# Altium schematic sheet [01] CPU.SchDoc
size A4
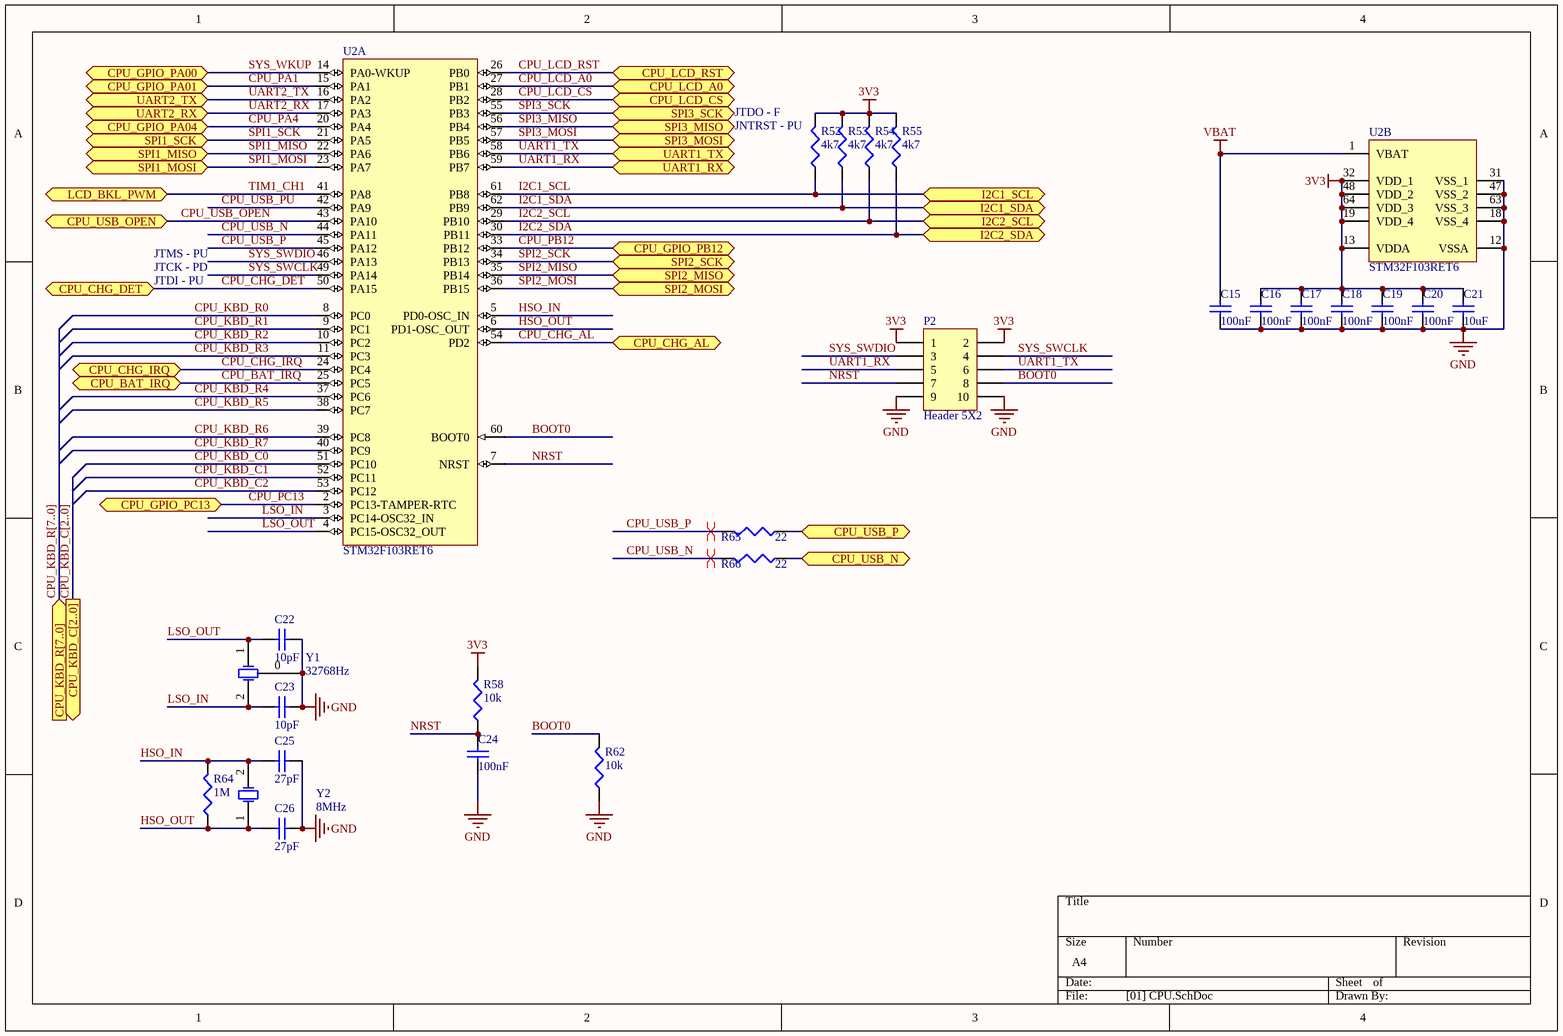
[diagram p0: [01] CPU.SchDoc]

## Parts
C15  value 100nF  [1608[0603]]  (hidden comment: Cap Semi)
C16  value 100nF  [1608[0603]]  (hidden comment: Cap Semi)
C17  value 100nF  [1608[0603]]  (hidden comment: Cap Semi)
C18  value 100nF  [1608[0603]]  (hidden comment: Cap Semi)
C19  value 100nF  [1608[0603]]  (hidden comment: Cap Semi)
C20  value 100nF  [1608[0603]]  (hidden comment: Cap Semi)
C21  value 10uF  [1608[0603]]  (hidden comment: Cap Semi)
C22  value 10pF  [1608[0603]]  (hidden comment: Cap Semi)
C23  value 10pF  [1608[0603]]  (hidden comment: Cap Semi)
C24  value 100nF  [1608[0603]]  (hidden comment: Cap Semi)
C25  value 27pF  [1608[0603]]  (hidden comment: Cap Semi)
C26  value 27pF  [1608[0603]]  (hidden comment: Cap Semi)
P2  Header 5X2  [HDR2X5]
R52  value 4k7  [J1-0603]  (hidden comment: Res3)
R53  value 4k7  [J1-0603]  (hidden comment: Res3)
R54  value 4k7  [J1-0603]  (hidden comment: Res3)
R55  value 4k7  [J1-0603]  (hidden comment: Res3)
R58  value 10k  [J1-0603]  (hidden comment: Res3)
R62  value 10k  [J1-0603]  (hidden comment: Res3)
R64  value 1M  [J1-0603]  (hidden comment: Res3)
R65  value 22  [J1-0603]  (hidden comment: Res3)
R66  value 22  [J1-0603]  (hidden comment: Res3)
U2  STM32F103RET6  [STM-LQFP64_N]  (parts A,B of 2)
Y1  32768Hz  [Crystal32k]
Y2  8MHz  [HC-49/US]

## Ports
CPU_BAT_IRQ (bidir), CPU_CHG_AL (bidir), CPU_CHG_DET (bidir), CPU_CHG_IRQ (bidir), CPU_GPIO_PA00 (bidir), CPU_GPIO_PA01 (bidir), CPU_GPIO_PA04 (bidir), CPU_GPIO_PB12 (bidir), CPU_GPIO_PC13 (bidir), CPU_KBD_C[2..0] (out), CPU_KBD_R[7..0] (in), CPU_LCD_A0 (bidir), CPU_LCD_CS (bidir), CPU_LCD_RST (bidir), CPU_USB_N (bidir), CPU_USB_OPEN (bidir), CPU_USB_P (bidir), I2C1_SCL (bidir), I2C1_SDA (bidir), I2C2_SCL (bidir), I2C2_SDA (bidir), LCD_BKL_PWM (bidir), SPI1_MISO (bidir), SPI1_MOSI (bidir), SPI1_SCK (bidir), SPI2_MISO (bidir), SPI2_MOSI (bidir), SPI2_SCK (bidir), SPI3_MISO (bidir), SPI3_MOSI (bidir), SPI3_SCK (bidir), UART1_RX (bidir), UART1_TX (bidir), UART2_RX (bidir), UART2_TX (bidir)

## Nets
3V3: C16.1 C17.1 C18.1 C19.1 C20.1 C21.1 P2.1 P2.2 R52.2 R53.2 R54.2 R55.2 R58.2 U2.13(VDDA) U2.19(VDD_4) U2.32(VDD_1) U2.48(VDD_2) U2.64(VDD_3)
GND: C15.2 C16.2 C17.2 C18.2 C19.2 C20.2 C21.2 C22.1 C23.1 C24.2 C25.1 C26.1 P2.9 P2.10 R62.1 U2.12(VSSA) U2.18(VSS_4) U2.31(VSS_1) U2.47(VSS_2) U2.63(VSS_3) Y1.0(CASE)
VBAT: C15.1 U2.1(VBAT)
BOOT0: P2.8 R62.2 U2.60(BOOT0)
CPU_BAT_IRQ: U2.25(PC5) ; port CPU_BAT_IRQ
CPU_CHG_AL: U2.54(PD2) ; port CPU_CHG_AL
CPU_CHG_DET: U2.50(PA15) ; port CPU_CHG_DET
CPU_CHG_IRQ: U2.24(PC4) ; port CPU_CHG_IRQ
CPU_KBD_C0: U2.51(PC10)
CPU_KBD_C1: U2.52(PC11)
CPU_KBD_C2: U2.53(PC12)
CPU_KBD_R0: U2.8(PC0)
CPU_KBD_R1: U2.9(PC1)
CPU_KBD_R2: U2.10(PC2)
CPU_KBD_R3: U2.11(PC3)
CPU_KBD_R4: U2.37(PC6)
CPU_KBD_R5: U2.38(PC7)
CPU_KBD_R6: U2.39(PC8)
CPU_KBD_R7: U2.40(PC9)
CPU_LCD_A0: U2.27(PB1) ; port CPU_LCD_A0
CPU_LCD_CS: U2.28(PB2) ; port CPU_LCD_CS
CPU_LCD_RST: U2.26(PB0) ; port CPU_LCD_RST
CPU_PA1: U2.15(PA1) ; port CPU_GPIO_PA01
CPU_PA4: U2.20(PA4) ; port CPU_GPIO_PA04
CPU_PB12: U2.33(PB12) ; port CPU_GPIO_PB12
CPU_PC13: U2.2(PC13-TAMPER-RTC) ; port CPU_GPIO_PC13
CPU_USB_N: R66.2 U2.44(PA11)
CPU_USB_N: R66.1 ; port CPU_USB_N  [a separate net that carries the same name]
CPU_USB_OPEN: U2.43(PA10) ; port CPU_USB_OPEN
CPU_USB_P: R65.2 U2.45(PA12)
CPU_USB_P: R65.1 ; port CPU_USB_P  [a separate net that carries the same name]
CPU_USB_PU: U2.42(PA9)
HSO_IN: C25.2 R64.2 U2.5(PD0-OSC_IN) Y2.2(OSC2)
HSO_OUT: C26.2 R64.1 U2.6(PD1-OSC_OUT) Y2.1(OSC1)
I2C1_SCL: R52.1 U2.61(PB8) ; port I2C1_SCL
I2C1_SDA: R53.1 U2.62(PB9) ; port I2C1_SDA
I2C2_SCL: R54.1 U2.29(PB10) ; port I2C2_SCL
I2C2_SDA: R55.1 U2.30(PB11) ; port I2C2_SDA
LSO_IN: C23.2 U2.3(PC14-OSC32_IN) Y1.2(OSC2)
LSO_OUT: C22.2 U2.4(PC15-OSC32_OUT) Y1.1(OSC1)
NRST: C24.1 P2.7 R58.1 U2.7(NRST)
SPI1_MISO: U2.22(PA6) ; port SPI1_MISO
SPI1_MOSI: U2.23(PA7) ; port SPI1_MOSI
SPI1_SCK: U2.21(PA5) ; port SPI1_SCK
SPI2_MISO: U2.35(PB14) ; port SPI2_MISO
SPI2_MOSI: U2.36(PB15) ; port SPI2_MOSI
SPI2_SCK: U2.34(PB13) ; port SPI2_SCK
SPI3_MISO: U2.56(PB4) ; port SPI3_MISO
SPI3_MOSI: U2.57(PB5) ; port SPI3_MOSI
SPI3_SCK: U2.55(PB3) ; port SPI3_SCK
SYS_SWCLK: P2.4 U2.49(PA14)
SYS_SWDIO: P2.3 U2.46(PA13)
SYS_WKUP: U2.14(PA0-WKUP) ; port CPU_GPIO_PA00
TIM1_CH1: U2.41(PA8) ; port LCD_BKL_PWM
UART1_RX: P2.5 U2.59(PB7) ; port UART1_RX
UART1_TX: P2.6 U2.58(PB6) ; port UART1_TX
UART2_RX: U2.17(PA3) ; port UART2_RX
UART2_TX: U2.16(PA2) ; port UART2_TX

## Buses and harness runs
bus CPU_KBD_C[2..0] = port CPU_KBD_C[2..0]
bus CPU_KBD_R[7..0] = port CPU_KBD_R[7..0]

## Layout directives
differential pair: CPU_USB_N, CPU_USB_P

## Notes on the sheet
- (near R52) JTDO - F
- (near R52) JNTRST - PU
- JTMS - PU
- JTCK - PD
- JTDI - PU

## Library data of the parts
C15-C26 = Cap Semi: Capacitor (Semiconductor SIM Model); Published: 8-Jun-2000; LatestRevisionDate: 29-May-2009; LatestRevisionNote: IPC-7351 Footprint Added.; PackageReference: C1206; Publisher: Altium Limited; PackageDescription: Chip Capacitor
P2 = Header 5X2: Header, 5-Pin, Dual row; LatestRevisionDate: 17-Jul-2002; LatestRevisionNote: Re-released for DXP Platform.; Publisher: Altium Limited
R52-R55 R58 R62 R64-R66 = Res3: Resistor; Published: 8-Jun-2000; LatestRevisionDate: 29-May-2009; LatestRevisionNote: IPC-7351 Footprint Added.; PackageReference: J1-0603; Publisher: Altium Limited; PackageDescription: Chip Resistor
U2 = STM32F103RET6: ARM Cortex-M3 32-bit MCU, 512 KB Flash, 64 KB Internal RAM, 51 I/Os, 64-pin LQFP, -40 to 85 degC, Tray; A/D Converter: 3x12-bit (16 Channel); D/A Converter: 2x12-bit (2 Channel); FLASH Size (Prog) (kB): 512; I/Os (High Current): 51; Internal RAM Size (kB): 64; Operating Frequency(F) (Processor speed) (MHz): 72; Supply Voltage(Vcc) min (V): 2; DatasheetVersion: Rev. 8; PackageVersion: Rev. 4, 06/2013; PackageReference: LQFP64; PackageDescription: 64-Pin Low Profile Quad Flat Package, 10 x 10 mm Body, 0.5 mm Pitch; Supplier 1: Digi-Key; Supplier Part Number 1: 497-6444-ND; Supplier 2: Farnell; Supplier Part Number 2: 1624138; Supplier 3: Newark; Supplier Part Number 3: 01P4101; Supplier 4: Newark; Supplier Part Number 4: 57P1231; Supplier 5: Mouser; Supplier Part Number 5: 511-STM32F103RET6; Core: ARM Cortex-M3; Packing: Tray; Mounting Technology: Surface Mount; PartNumber: STM32F103RET6; ComponentLink1Description: Manufacturer URL; ComponentLink1URL: http://www.st.com/web/en/home.html; ComponentLink2Description: Datasheet; ComponentLink2URL: http://www.st.com/st-web-ui/static/active/en/resource/technical/document/datasheet/CD00191185.pdf; ComponentLink3Description: Package Specification; ComponentLink3URL: http://www.st.com/st-web-ui/static/active/en/resource/technical/document/datasheet/DM00037051.pdf
Y1 = XTAL: Crystal Oscillator; Published: 8-Jun-2000; LatestRevisionDate: 17-Jul-2002; LatestRevisionNote: Re-released for DXP Platform.; PackageReference: R38; Publisher: Altium Limited; PackageDescription: Crystal, Thru-Hole; 2 Leads; Body 3.1 x 8.2 mm (Dia.xH)
Y2 = XTAL_1: Crystal Oscillator; Published: 8-Jun-2000; LatestRevisionDate: 17-Jul-2002; LatestRevisionNote: Re-released for DXP Platform.; PackageReference: R38; Publisher: Altium Limited; PackageDescription: Crystal, Thru-Hole; 2 Leads; Body 3.1 x 8.2 mm (Dia.xH)